# Altium schematic sheet MB1075.SchDoc
size A4; DocumentNumber: 1; Revision: C.01; SheetNumber: 1; SheetTotal: 7
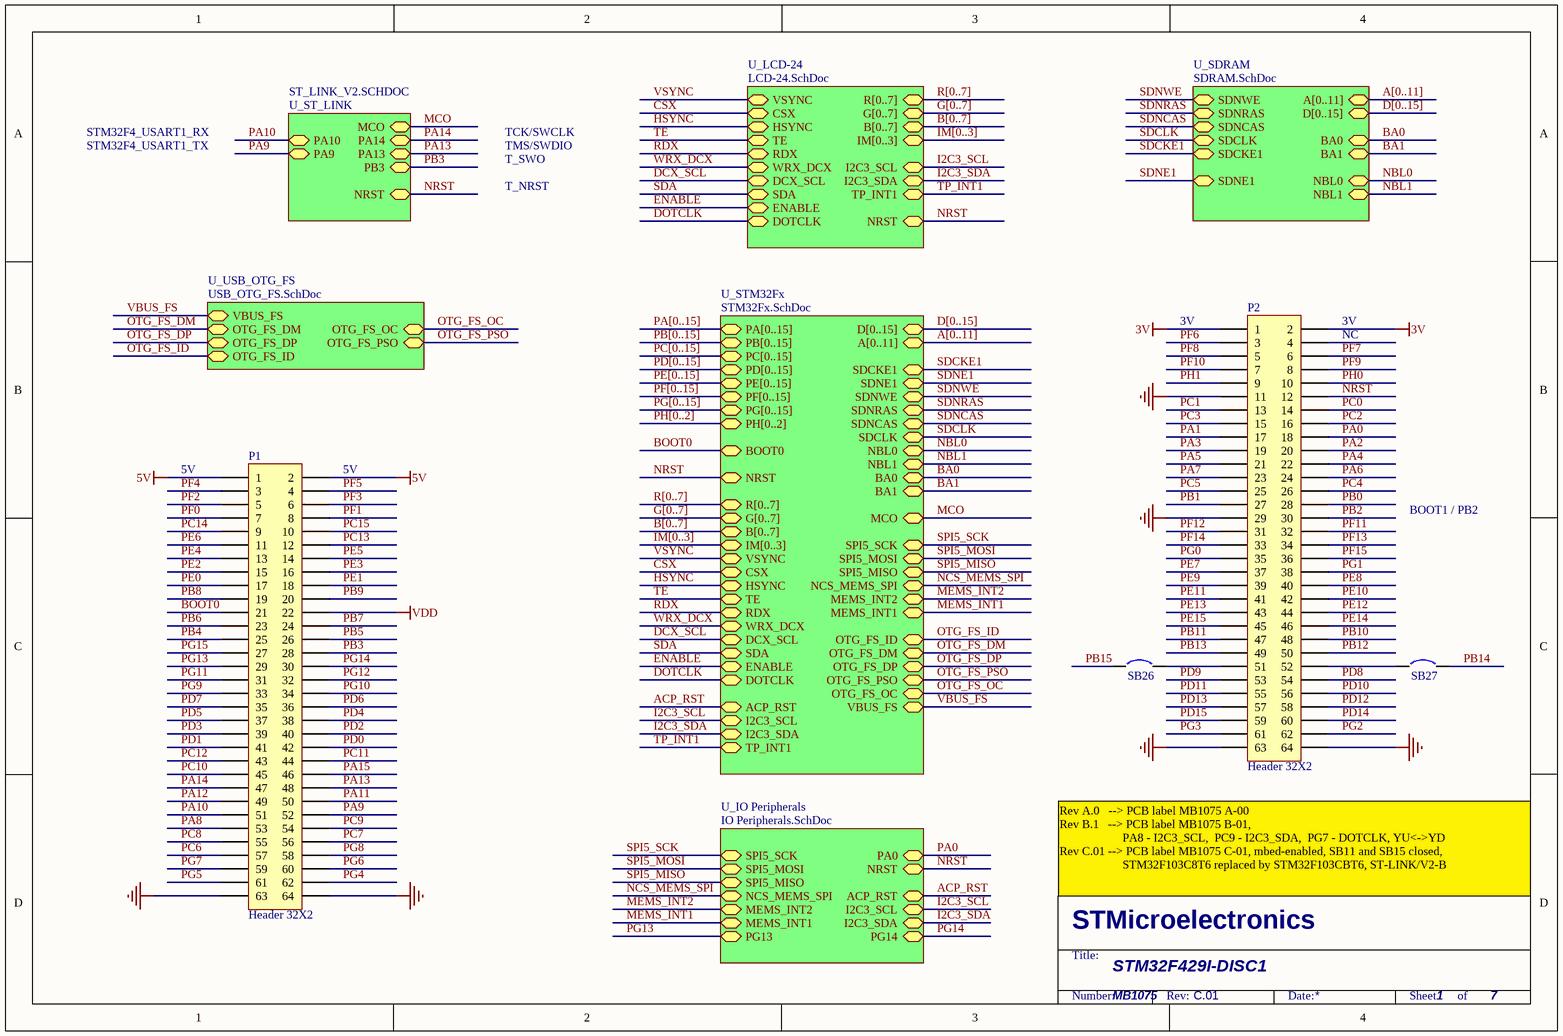
[diagram p0: MB1075.SchDoc]

## Parts
P1  Header 32X2  [HDR2X32]
P2  Header 32X2  [HDR2X32]
SB26  Circuit Breaker  [JP2_SMD]  (value not drawn)
SB27  Circuit Breaker  [JP2_SMD]  (value not drawn)

## Sub-sheets
U_IO Peripherals = IO Peripherals.SchDoc: PA0, NRST, MEMS_INT1, NCS_MEMS_SPI, MEMS_INT2, SPI5_SCK, SPI5_MISO, SPI5_MOSI, ACP_RST, I2C3_SCL, I2C3_SDA, PG13, PG14
U_LCD-24 = LCD-24.SchDoc: NRST, B[0..7], G[0..7], R[0..7], IM[0..3], TP_INT1, VSYNC, CSX, HSYNC, TE, WRX_DCX, RDX, ENABLE, DCX_SCL, SDA, I2C3_SCL, I2C3_SDA, DOTCLK
U_SDRAM = SDRAM.SchDoc: A[0..11], D[0..15], SDNE1, NBL1, NBL0, SDNWE, SDNRAS, SDNCAS, SDCLK, SDCKE1, BA0, BA1
U_ST_LINK = ST_LINK_V2.SCHDOC: PA13, PA14, NRST, PB3, MCO, PA10, PA9
U_STM32Fx = STM32Fx.SchDoc: BOOT0, NRST, MCO, D[0..15], A[0..11], SDCKE1, SDNE1, SDNWE, NBL0, SDNRAS, NBL1, SDCLK, SDNCAS, BA0, BA1, PA[0..15], PB[0..15], PC[0..15], PD[0..15], PE[0..15], PH[0..2], PF[0..15], PG[0..15], R[0..7], G[0..7], B[0..7], IM[0..3], TP_INT1, VSYNC, CSX, HSYNC, TE, WRX_DCX, RDX, ENABLE, DCX_SCL, SDA, I2C3_SCL, I2C3_SDA, ACP_RST, MEMS_INT1, NCS_MEMS_SPI, MEMS_INT2, SPI5_SCK, SPI5_MISO, SPI5_MOSI, OTG_FS_ID, OTG_FS_DM, OTG_FS_DP, OTG_FS_PSO, OTG_FS_OC, VBUS_FS, DOTCLK
U_USB_OTG_FS = USB_OTG_FS.SchDoc: OTG_FS_PSO, OTG_FS_OC, OTG_FS_DM, OTG_FS_DP, OTG_FS_ID, VBUS_FS

## Nets
3V: P2.1 P2.2
5V: P1.1 P1.2
GND: P1.63 P1.64 P2.11 P2.29 P2.63 P2.64
VDD: P1.22
ACP_RST: sheet U_IO Peripherals/ACP_RST, sheet U_STM32Fx/ACP_RST
BA0: sheet U_SDRAM/BA0, sheet U_STM32Fx/BA0
BA1: sheet U_SDRAM/BA1, sheet U_STM32Fx/BA1
BOOT0: P1.21 ; sheet U_STM32Fx/BOOT0
CSX: sheet U_STM32Fx/CSX, sheet U_LCD-24/CSX
DCX_SCL: sheet U_STM32Fx/DCX_SCL, sheet U_LCD-24/DCX_SCL
DOTCLK: sheet U_STM32Fx/DOTCLK, sheet U_LCD-24/DOTCLK
ENABLE: sheet U_STM32Fx/ENABLE, sheet U_LCD-24/ENABLE
HSYNC: sheet U_STM32Fx/HSYNC, sheet U_LCD-24/HSYNC
I2C3_SCL: sheet U_IO Peripherals/I2C3_SCL, sheet U_STM32Fx/I2C3_SCL, sheet U_LCD-24/I2C3_SCL
I2C3_SDA: sheet U_IO Peripherals/I2C3_SDA, sheet U_STM32Fx/I2C3_SDA, sheet U_LCD-24/I2C3_SDA
MCO: sheet U_STM32Fx/MCO, sheet U_ST_LINK/MCO
MEMS_INT1: sheet U_IO Peripherals/MEMS_INT1, sheet U_STM32Fx/MEMS_INT1
MEMS_INT2: sheet U_IO Peripherals/MEMS_INT2, sheet U_STM32Fx/MEMS_INT2
NBL0: sheet U_SDRAM/NBL0, sheet U_STM32Fx/NBL0
NBL1: sheet U_SDRAM/NBL1, sheet U_STM32Fx/NBL1
NCS_MEMS_SPI: sheet U_IO Peripherals/NCS_MEMS_SPI, sheet U_STM32Fx/NCS_MEMS_SPI
NRST: P2.12 ; sheet U_IO Peripherals/NRST, sheet U_STM32Fx/NRST, sheet U_ST_LINK/NRST, sheet U_LCD-24/NRST
OTG_FS_DM: sheet U_STM32Fx/OTG_FS_DM, sheet U_USB_OTG_FS/OTG_FS_DM
OTG_FS_DP: sheet U_STM32Fx/OTG_FS_DP, sheet U_USB_OTG_FS/OTG_FS_DP
OTG_FS_ID: sheet U_STM32Fx/OTG_FS_ID, sheet U_USB_OTG_FS/OTG_FS_ID
OTG_FS_OC: sheet U_STM32Fx/OTG_FS_OC, sheet U_USB_OTG_FS/OTG_FS_OC
OTG_FS_PSO: sheet U_STM32Fx/OTG_FS_PSO, sheet U_USB_OTG_FS/OTG_FS_PSO
PA0: P2.18 ; sheet U_IO Peripherals/PA0
PA1: P2.17
PA2: P2.20
PA3: P2.19
PA4: P2.22
PA5: P2.21
PA6: P2.24
PA7: P2.23
PA8: P1.53
PA9: P1.52 ; sheet U_ST_LINK/PA9
PA10: P1.51 ; sheet U_ST_LINK/PA10
PA11: P1.50
PA12: P1.49
PA13: P1.48 ; sheet U_ST_LINK/PA13
PA14: P1.47 ; sheet U_ST_LINK/PA14
PA15: P1.46
PB0: P2.28
PB1: P2.27
PB2: P2.30
PB3: P1.28 ; sheet U_ST_LINK/PB3
PB4: P1.25
PB5: P1.26
PB6: P1.23
PB7: P1.24
PB8: P1.19
PB9: P1.20
PB10: P2.48
PB11: P2.47
PB12: P2.50
PB13: P2.49
PB14: SB27.2
PB15: SB26.1
PC0: P2.14
PC1: P2.13
PC2: P2.16
PC3: P2.15
PC4: P2.26
PC5: P2.25
PC6: P1.57
PC7: P1.56
PC8: P1.55
PC9: P1.54
PC10: P1.45
PC11: P1.44
PC12: P1.43
PC13: P1.12
PC14: P1.9
PC15: P1.10
PD0: P1.42
PD1: P1.41
PD2: P1.40
PD3: P1.39
PD4: P1.38
PD5: P1.37
PD6: P1.36
PD7: P1.35
PD8: P2.54
PD9: P2.53
PD10: P2.56
PD11: P2.55
PD12: P2.58
PD13: P2.57
PD14: P2.60
PD15: P2.59
PE0: P1.17
PE1: P1.18
PE2: P1.15
PE3: P1.16
PE4: P1.13
PE5: P1.14
PE6: P1.11
PE7: P2.37
PE8: P2.40
PE9: P2.39
PE10: P2.42
PE11: P2.41
PE12: P2.44
PE13: P2.43
PE14: P2.46
PE15: P2.45
PF0: P1.7
PF1: P1.8
PF2: P1.5
PF3: P1.6
PF4: P1.3
PF5: P1.4
PF6: P2.3
PF7: P2.6
PF8: P2.5
PF9: P2.8
PF10: P2.7
PF11: P2.32
PF12: P2.31
PF13: P2.34
PF14: P2.33
PF15: P2.36
PG0: P2.35
PG1: P2.38
PG2: P2.62
PG3: P2.61
PG4: P1.62
PG5: P1.61
PG6: P1.60
PG7: P1.59
PG8: P1.58
PG9: P1.33
PG10: P1.34
PG11: P1.31
PG12: P1.32
PG13: P1.29 ; sheet U_IO Peripherals/PG13
PG14: P1.30 ; sheet U_IO Peripherals/PG14
PG15: P1.27
PH0: P2.10
PH1: P2.9
RDX: sheet U_STM32Fx/RDX, sheet U_LCD-24/RDX
SDA: sheet U_STM32Fx/SDA, sheet U_LCD-24/SDA
SDCKE1: sheet U_SDRAM/SDCKE1, sheet U_STM32Fx/SDCKE1
SDCLK: sheet U_SDRAM/SDCLK, sheet U_STM32Fx/SDCLK
SDNCAS: sheet U_SDRAM/SDNCAS, sheet U_STM32Fx/SDNCAS
SDNE1: sheet U_SDRAM/SDNE1, sheet U_STM32Fx/SDNE1
SDNRAS: sheet U_SDRAM/SDNRAS, sheet U_STM32Fx/SDNRAS
SDNWE: sheet U_SDRAM/SDNWE, sheet U_STM32Fx/SDNWE
SPI5_MISO: sheet U_IO Peripherals/SPI5_MISO, sheet U_STM32Fx/SPI5_MISO
SPI5_MOSI: sheet U_IO Peripherals/SPI5_MOSI, sheet U_STM32Fx/SPI5_MOSI
SPI5_SCK: sheet U_IO Peripherals/SPI5_SCK, sheet U_STM32Fx/SPI5_SCK
TE: sheet U_STM32Fx/TE, sheet U_LCD-24/TE
TP_INT1: sheet U_STM32Fx/TP_INT1, sheet U_LCD-24/TP_INT1
VBUS_FS: sheet U_STM32Fx/VBUS_FS, sheet U_USB_OTG_FS/VBUS_FS
VSYNC: sheet U_STM32Fx/VSYNC, sheet U_LCD-24/VSYNC
WRX_DCX: sheet U_STM32Fx/WRX_DCX, sheet U_LCD-24/WRX_DCX
NetP2_51: P2.51 SB26.2
NetP2_52: P2.52 SB27.1

Not connected (* = marked no-connect by the designer): P2 4

## Buses and harness runs
bus A[0..11] = sheet U_SDRAM/A[0..11]
bus A[0..11] = sheet U_STM32Fx/A[0..11]
bus B[0..7] = sheet U_LCD-24/B[0..7]
bus B[0..7] = sheet U_STM32Fx/B[0..7]
bus D[0..15] = sheet U_SDRAM/D[0..15]
bus D[0..15] = sheet U_STM32Fx/D[0..15]
bus G[0..7] = sheet U_LCD-24/G[0..7]
bus G[0..7] = sheet U_STM32Fx/G[0..7]
bus IM[0..3] = sheet U_LCD-24/IM[0..3]
bus IM[0..3] = sheet U_STM32Fx/IM[0..3]
bus PA[0..15] = sheet U_STM32Fx/PA[0..15]
bus PB[0..15] = sheet U_STM32Fx/PB[0..15]
bus PC[0..15] = sheet U_STM32Fx/PC[0..15]
bus PD[0..15] = sheet U_STM32Fx/PD[0..15]
bus PE[0..15] = sheet U_STM32Fx/PE[0..15]
bus PF[0..15] = sheet U_STM32Fx/PF[0..15]
bus PG[0..15] = sheet U_STM32Fx/PG[0..15]
bus PH[0..2] = sheet U_STM32Fx/PH[0..2]
bus R[0..7] = sheet U_LCD-24/R[0..7]
bus R[0..7] = sheet U_STM32Fx/R[0..7]

## Notes on the sheet
- STM32F4_USART1_TX
- STM32F4_USART1_RX
- TCK/SWCLK
- TMS/SWDIO
- T_SWO
- T_NRST
- 3V
- (near P2) NC
- (near P2) 3V
- 5V
- (near P1) 5V
- BOOT1 / PB2
- Rev A.0   --> PCB label MB1075 A-00
  Rev B.1   --> PCB label MB1075 B-01,
  PA8 - I2C3_SCL,  PC9 - I2C3_SDA,  PG7 - DOTCLK, YU<->YD
  Rev C.01 --> PCB label MB1075 C-01, mbed-enabled, SB11 and SB15 closed,
  STM32F103C8T6 replaced by STM32F103CBT6, ST-LINK/V2-B
- STM32F429I-DISC1
- MB1075
- STMicroelectronics
- Title:
- Number:
- Rev:
- Date:
- Sheet       of

## Library data of the parts
P1 P2 = Header 32X2: Header, 32-Pin, Dual row; LatestRevisionDate: 17-Jul-2002; LatestRevisionNote: Re-released for DXP Platform.; Publisher: Altium Limited
SB26 SB27 = Circuit Breaker: Solder: NO; Published: 24-Mar-1999; Revision: July-2002: Re-released for DXP Platform.; Publisher: Altium Limited